# Altium schematic sheet mpu6050.SchDoc
size A4
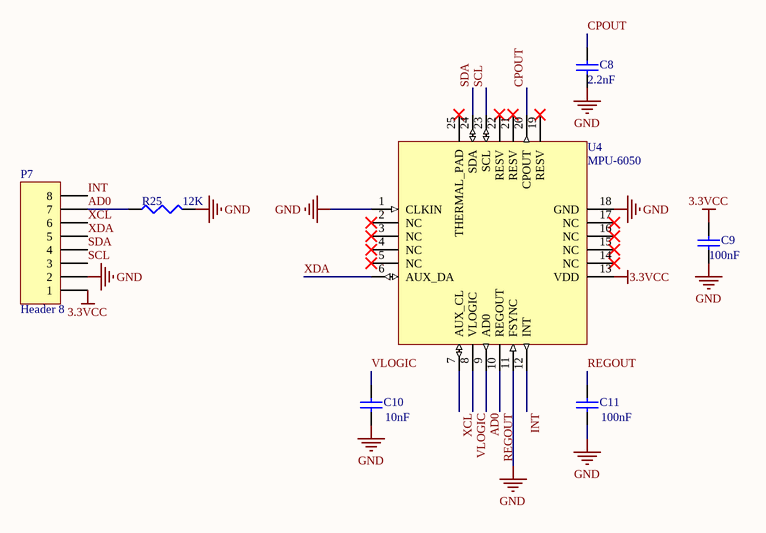
[diagram p0: mpu6050.SchDoc]

## Parts
C8  value 2.2nF  [C1206]  (hidden comment: Cap Semi)
C9  value 100nF  [C1206]  (hidden comment: Cap Semi)
C10  value 10nF  [C1206]  (hidden comment: Cap Semi)
C11  value 100nF  [C1206]  (hidden comment: Cap Semi)
P7  Header 8  [HDR1X8]
R25  value 12K  [J1-0603]  (hidden comment: Res3)
U4  MPU-6050  [QFN50P400X400X95-25N]

## Nets
3.3VCC: C9.2 P7.1 U4.13(VDD)
GND: C8.1 C9.1 C10.1 C11.1 P7.2 R25.2 U4.1(CLKIN) U4.11(FSYNC) U4.18(GND)
AD0: P7.7 R25.1 U4.9(AD0)
CPOUT: C8.2 U4.20(CPOUT)
INT: P7.8 U4.12(INT)
REGOUT: C11.2 U4.10(REGOUT)
SCL: P7.3 U4.23(SCL)
SDA: P7.4 U4.24(SDA)
VLOGIC: C10.2 U4.8(VLOGIC)
XCL: P7.6 U4.7(AUX_CL)
XDA: P7.5 U4.6(AUX_DA)

Not connected (* = marked no-connect by the designer): U4 2(NC)* 3(NC)* 4(NC)* 5(NC)* 14(NC)* 15(NC)* 16(NC)* 17(NC)* 19(RESV)* 21(RESV)* 22(RESV)* 25(THERMAL_PAD)*

## Library data of the parts
C8-C11 = Cap Semi: Capacitor (Semiconductor SIM Model); Published: 8-Jun-2000; LatestRevisionDate: 29-May-2009; LatestRevisionNote: IPC-7351 Footprint Added.; PackageReference: C1206; Publisher: Altium Limited; PackageDescription: Chip Capacitor
P7 = Header 8: Header, 8-Pin; LatestRevisionDate: 17-Jul-2002; LatestRevisionNote: Re-released for DXP Platform.; Publisher: Altium Limited
R25 = Res3: Resistor; Published: 8-Jun-2000; LatestRevisionDate: 29-May-2009; LatestRevisionNote: IPC-7351 Footprint Added.; PackageReference: J1-0603; Publisher: Altium Limited; PackageDescription: Chip Resistor
U4 = MPU-6050: INVENSENSE - Módulo MEMS, Giroscopio de Tres Ejes, Acelerómetro de Tres Ejes; ComponentLink1Description: farnell; ComponentLink1URL: https://es.farnell.com/invensense/mpu-6050/giroscop-aceler-m-6-ejes-i2c-qfn/dp/1864742?st=MPU-6050